# Altium schematic sheet Sheet1.SchDoc
size A4
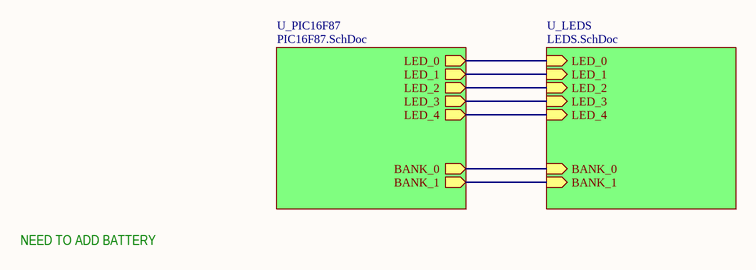
[diagram p0: Sheet1.SchDoc]

## Sub-sheets
U_LEDS = LEDS.SchDoc: LED_0 (in), LED_1 (in), LED_2 (in), LED_3 (in), LED_4 (in), BANK_0 (in), BANK_1 (in)
U_PIC16F87 = PIC16F87.SchDoc: LED_0 (out), LED_1 (out), LED_2 (out), LED_3 (out), LED_4 (out), BANK_0 (out), BANK_1 (out)

## Nets
(unnamed): sheet U_LEDS/LED_0, sheet U_PIC16F87/LED_0
(unnamed): sheet U_LEDS/LED_1, sheet U_PIC16F87/LED_1
(unnamed): sheet U_LEDS/LED_2, sheet U_PIC16F87/LED_2
(unnamed): sheet U_LEDS/LED_3, sheet U_PIC16F87/LED_3
(unnamed): sheet U_LEDS/LED_4, sheet U_PIC16F87/LED_4
(unnamed): sheet U_LEDS/BANK_0, sheet U_PIC16F87/BANK_0
(unnamed): sheet U_LEDS/BANK_1, sheet U_PIC16F87/BANK_1

## Notes on the sheet
- NEED TO ADD BATTERY